# Altium schematic sheet Generador de ozono.SchDoc: Generador de ozono
size A; Date: 27/06/2020; CheckedBy: Christian Ledwidth; Author: Nahuel Martinez; SheetNumber: 1; SheetTotal: 1; DocumentName: Generador de ozono
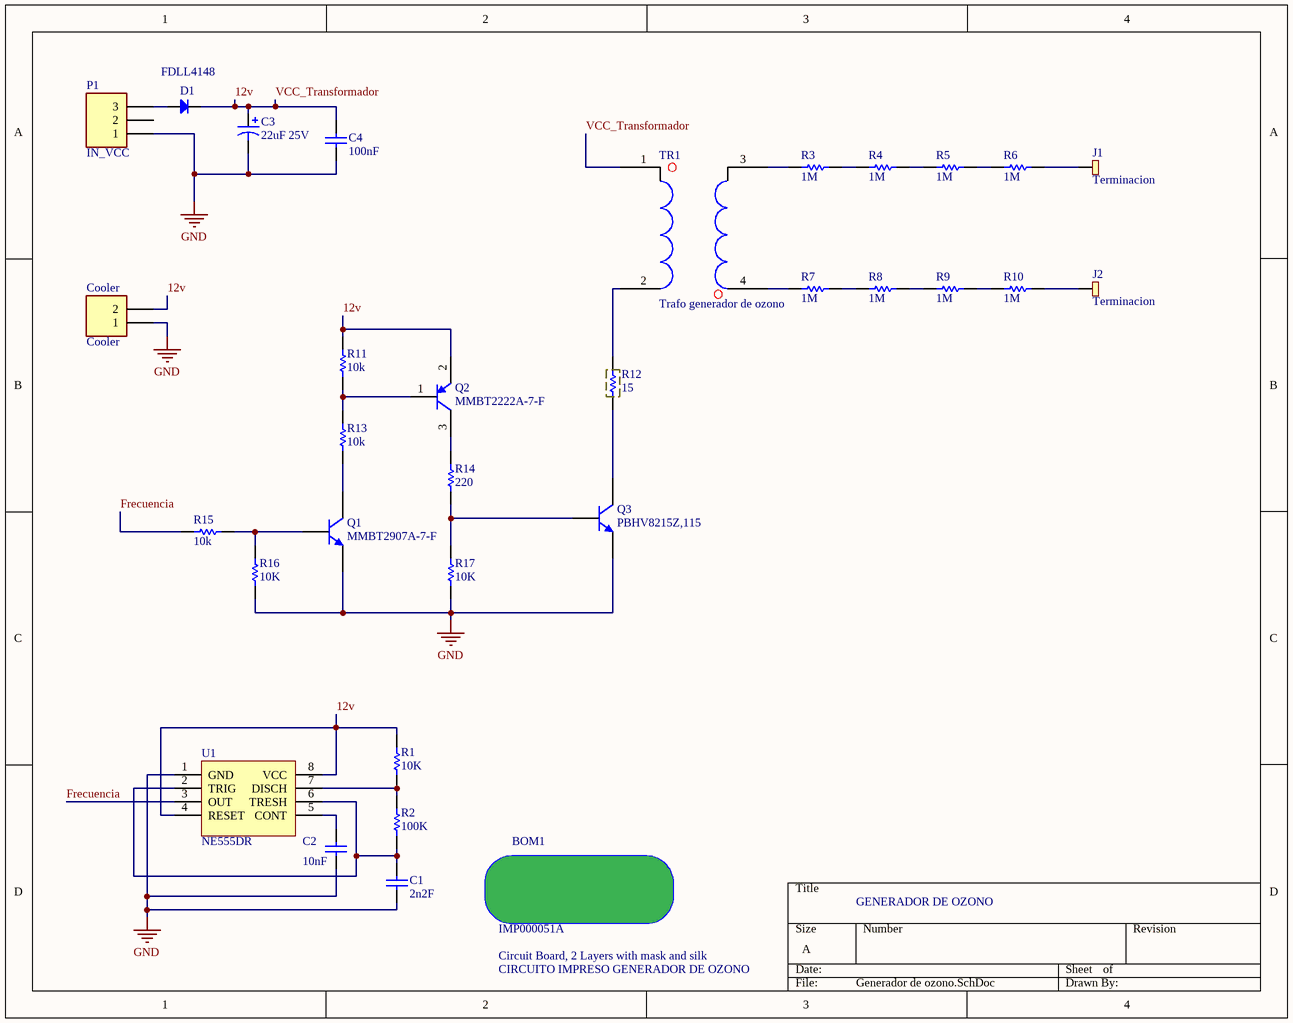
[diagram p0: Generador de ozono.SchDoc]

## Parts
BOM1  CIRCUITO IMPRESO GENERADOR DE OZONO  Codigo Body: IMP000051A  (mechanical)
C1  2n2F  [C_0603]
C2  10nF  [C_0603]
C3  22uF 25V  [CAP100RP]
C4  100nF  [C_0603]
Cooler  Cooler  [B2B-XH-A_3D]
D1  FDLL4148  [SOD-80/MLL34]
J1  Terminacion  [Terminacion]
J2  Terminacion  [Terminacion]
P1  IN_VCC  [B3B-XH-A_3D]
Q1  MMBT2907A-7-F  [SOT23]
Q2  MMBT2222A-7-F  [SOT23]
Q3  PBHV8215Z,115  [SOT223]
R1  10K  [R_0603]
R2  100K  [R_0603]
R3  1M  [R_2512]
R4  1M  [R_2512]
R5  1M  [R_2512]
R6  1M  [R_2512]
R7  1M  [R_2512]
R8  1M  [R_2512]
R9  1M  [R_2512]
R10  1M  [R_2512]
R11  10k  [R_0603]
R12  15  [RES_CEMENTADA_5W_VERT]
R13  10k  [R_0603]
R14  220  [R_1206]
R15  10k  [R_0603]
R16  10K  [R_0603]
R17  10K  [R_0603]
TR1  Trafo generador de ozono  [TRAFO VACIO]
U1  NE555DR  [SOIC8]

## Nets
GND: C1.1 C2.1 C3.2 C4.1 Cooler.1 P1.1 Q1.2(E) Q3.3(E) R16.1 R17.1 U1.1(GND)
12v: C3.1 C4.2 Cooler.2 D1.2(K) Q2.2(E) R1.2 R11.2 TR1.1 U1.4(RESET) U1.8(VCC)  [also labelled VCC_Transformador]
Frecuencia: R15.2 U1.3(OUT)
NetC1_2: C1.2 R2.1 U1.2(TRIG) U1.6(TRESH)
NetC2_2: C2.2 U1.5(CONT)
NetD1_1: D1.1(A) P1.3
NetJ1_?1: J1.?1 R6.2
NetJ2_?1: J2.?1 R10.2
NetQ1_1: Q1.1(B) R15.1 R16.2
NetQ1_3: Q1.3(C) R13.1
NetQ2_1: Q2.1(B) R11.1 R13.2
NetQ2_3: Q2.3(C) R14.2
NetQ3_1: Q3.1(B) R14.1 R17.2
NetQ3_2: Q3.2(C) R12.2
NetR1_1: R1.1 R2.2 U1.7(DISCH)
NetR3_1: R3.1 TR1.3
NetR3_2: R3.2 R4.1
NetR4_2: R4.2 R5.1
NetR5_2: R5.2 R6.1
NetR7_1: R7.1 TR1.4
NetR7_2: R7.2 R8.1
NetR8_2: R8.2 R9.1
NetR9_2: R9.2 R10.1
NetR12_1: R12.1 TR1.2

Not connected (* = marked no-connect by the designer): P1 2

## Notes on the sheet
- GENERADOR DE OZONO

## Library data of the parts
BOM1 = CIRCUITO IMPRESO: Circuit Board, 2 Layers with mask and silk; Fabricante: PCBCART; Note: Circuit Board, 2 Layers with mask and silk; Value: CIRCUITO IMPRESO GENERADOR DE OZONO; Cod.Fabricante: IMP000051A
C1 = C_2n2F_0603: CAP CER 2200PF 50V X7R 0603; Note: Footprint corresponds to dimensions for bulk cassette packaging. This case size has tightened tolerances.; Cod.Fabricante: C0603C222M5RACTU; Fabricante: KEMET; Published: 17-Jul-2002; LatestRevisionDate: 19-Mar-2004; LatestRevisionNote: Silkscreen size reduced.; DatasheetDocument: Mar-2001; PackageDocument: Mar-2001; PackageReference: 0603; Publisher: Altium Limited; ComponentLink1Description: Manufacturer Link; ComponentLink1URL: http://www.kemet.com/; ComponentLink2Description: Datasheet; ComponentLink2URL: https://api.kemet.com/component-edge/download/datasheet/C0603C103M5RACTU.pdf; Cod.Digikey: 399-9042-1-ND; Value: 2n2F; DIGIKEYx100: 0.02980
C2 = C_10nF_0603: CAP CER 10000PF 50V X7R 0603; Note: Footprint corresponds to dimensions for bulk cassette packaging. This case size has tightened tolerances.; Cod.Fabricante: C0603C103M5RACTU; Fabricante: KEMET; Published: 17-Jul-2002; LatestRevisionDate: 19-Mar-2004; LatestRevisionNote: Silkscreen size reduced.; DatasheetDocument: Mar-2001; PackageDocument: Mar-2001; PackageReference: 0603; Publisher: Altium Limited; ComponentLink1Description: Manufacturer Link; ComponentLink1URL: http://www.kemet.com/; ComponentLink2Description: Datasheet; ComponentLink2URL: https://api.kemet.com/component-edge/download/datasheet/C0603C103M5RACTU.pdf; Cod.Digikey: 399-7842-1-ND; Value: 10nF; DIGIKEYx100: 0.01550
C3 = CAP_ALUM_22UF_25V: CAP ALUM 22UF 20% 25V RADIAL; Cod.Fabricante: UVR1E220MDD; Fabricante: Nichicon; Published: 8-Jun-2000; LatestRevisionDate: 17-Jul-2002; LatestRevisionNote: Re-released for DXP Platform.; Publisher: Altium Limited; PackageDescription: Radial, Can; Value: 22uF 25V; Cod.Digikey: 493-1058-ND; DIGIKEYx100: 0.08420; ComponentLink2URL: http://nichicon-us.com/english/products/pdfs/e-uvr.pdf; ComponentLink2Description: Datasheet
C4 = C_100nF_0603: CAP CER 0.1UF 50V X7R 0603; Note: Footprint corresponds to dimensions for bulk cassette packaging. This case size has tightened tolerances.; Cod.Fabricante: C0603C104M5RACTU; Fabricante: KEMET; Published: 17-Jul-2002; LatestRevisionDate: 19-Mar-2004; LatestRevisionNote: Silkscreen size reduced.; DatasheetDocument: Mar-2001; PackageDocument: Mar-2001; PackageReference: 0603; Publisher: Altium Limited; ComponentLink1Description: Manufacturer Link; ComponentLink1URL: http://www.kemet.com/; ComponentLink2Description: Datasheet; ComponentLink2URL: https://api.kemet.com/component-edge/download/datasheet/C0603C104M5RACTU.pdf; Cod.Digikey: 399-7845-1-ND; Value: 100nF; DIGIKEYx100: 0.01740
Cooler = JST_2.5_2: CONN HEADER XH TOP 2POS 2.5MM; Cod.Fabricante: B2B-XH-A(LF)(SN); Fabricante: JST Sales America Inc.; LatestRevisionDate: 17-Jul-2002; LatestRevisionNote: Re-released for DXP Platform.; Publisher: Altium Limited; Cod.Digikey: 455-2247-ND; DIGIKEYx100: 0.0868; ComponentLink2URL: http://www.jst-mfg.com/product/pdf/eng/eXH.pdf; ComponentLink2Description: Datasheet
D1 = Diode FDLL4148: DIODE GEN PURP 100V 200MA LL34/SOD80/MINI MELF; Fabricante: ON Semiconductor; Published: 8-Jun-2000; LatestRevisionDate: 17-Jul-2002; LatestRevisionNote: Re-released for DXP Platform.; DatasheetDocument: 1998; PackageDocument: Aug-1999; PackageReference: MINI MELF; Publisher: Altium Limited; Code_JEDEC: MINI MELF; ComponentLink1Description: Manufacturer Link; ComponentLink1URL: https://www.fairchildsemi.com; ComponentLink2Description: Datasheet; ComponentLink2URL: https://www.fairchildsemi.com/datasheets/FD/FDLL4148.pdf; Value: FDLL4148; Cod.Digikey: FDLL4148CT-ND; Cod.Fabricante: FDLL4148; DIGIKEYx100: 0.0487
J1 J2 = Terminacion: Pad para terminar un camino - No es un componente; Value: No es un componente
P1 = JST_2.5_3: CONN HEADER XH TOP 3POS 2.5MM; Cod.Fabricante: B3B-XH-A(LF)(SN); Fabricante: JST Sales America Inc.; LatestRevisionDate: 17-Jul-2002; LatestRevisionNote: Re-released for DXP Platform.; Publisher: Altium Limited; Cod.Digikey: 455-2248-ND; ComponentLink2Description: Datasheet; ComponentLink2URL: http://www.jst-mfg.com/product/pdf/eng/eXH.pdf; DIGIKEYx100: 0.1115
Q1 = MMBT2907A-7-F: TRANS PNP 60V 0.6A SOT23-3; Fabricante: Diodes Incorporated; PackageReference: SOT-23-3; Publisher: Altium Limited; PackageDescription: SOT-23-3; ComponentLink1Description: Manufacturer Link; ComponentLink1URL: https://media.digikey.com/pdf/Data%20Sheets/Diodes%20PDFs/MMBT2907A_Rev2016.pdf; ComponentLink2Description: Datasheet; ComponentLink2URL: https://media.digikey.com/pdf/Data%20Sheets/Diodes%20PDFs/MMBT2907A_Rev2016.pdf; Value: MMBT2907A-7-F; Cod.Digikey: MMBT2907A-FDICT-ND; Cod.Fabricante: MMBT2907A-7-F; DIGIKEYx100: 0.05110
Q2 = MMBT2222A-7-F: TRANS NPN 40V 0.6A SMD SOT23-3; Fabricante: Diodes Incorporated; LatestRevisionDate: 17-Jul-2002; LatestRevisionNote: Re-released for DXP Platform.; PackageReference: SOT-23-3; Publisher: Altium Limited; ComponentLink1Description: Manufacturer Link; ComponentLink1URL: https://www.diodes.com/assets/Datasheets/ds30041.pdf; ComponentLink2Description: Datasheet; ComponentLink2URL: https://www.diodes.com/assets/Datasheets/ds30041.pdf; Value: MMBT2222A-7-F; Cod.Digikey: MMBT2222A-FDICT-ND; Cod.Fabricante: MMBT2222A-7-F; DIGIKEYx100: 0.05000
Q3 = PBHV8215Z,115: TRANS NPN 150V 2A SOT223; Fabricante: Nexperia USA Inc.; PackageReference: SOT-223; Publisher: Altium Limited; PackageDescription: SOT-223; ComponentLink1Description: Manufacturer Link; ComponentLink1URL: https://assets.nexperia.com/documents/data-sheet/PBHV8215Z.pdf; ComponentLink2Description: Datasheet; ComponentLink2URL: https://assets.nexperia.com/documents/data-sheet/PBHV8215Z.pdf; Value: PBHV8215Z,115; Cod.Digikey: 1727-5084-6-ND; Cod.Fabricante: PBHV8215Z,115; DIGIKEYx100: 0.27300
R1 R11 R13 R15-R17 = R_10k_0603: RES SMD 10K OHM 5% 1/10W 0603; Cod.Fabricante: RC0603JR-0710KL; Fabricante: Yageo; Published: 8-Jun-2000; LatestRevisionDate: 17-Jul-2002; LatestRevisionNote: Re-released for DXP Platform.; PackageReference: 0603; Publisher: Altium Limited; Cod.Digikey: 311-10KGRCT-ND; DIGIKEYx100: 0.00770
  R1 R16 R17: Value: 10K
  R11 R13 R15: Value: 10k
R2 = R_100k_0603: RES SMD 100K OHM 5% 1/10W 0603; Cod.Fabricante: RC0603JR-07100KL; Fabricante: Yageo; Published: 8-Jun-2000; LatestRevisionDate: 17-Jul-2002; LatestRevisionNote: Re-released for DXP Platform.; PackageReference: 0603; Publisher: Altium Limited; Cod.Digikey: 311-100KGRCT-ND; Value: 100K; DIGIKEYx100: 0.00770
R3-R10 = R_1M_2512: 1 MOhms ±5% 1W Chip Resistor 2512 (6432 Metric) High Voltage Thick Film; Cod.Fabricante: CHV2512-JW-105ELF; Fabricante: Bourns Inc.; Published: 8-Jun-2000; LatestRevisionDate: 17-Jul-2002; LatestRevisionNote: Re-released for DXP Platform.; PackageReference: 2512; Publisher: Altium Limited; Cod.Digikey: 118-CHV2512-JW-105ELFCT-ND; Value: 1M; DIGIKEYx100: 0.27280
R12 = Resistor-15_5W: 15 Ohms ±5% 5W Through Hole Resistor Radial; Cod.Fabricante: SQMW515RJ; Fabricante: TE Connectivity Passive Product; Published: 8-Jun-2000; LatestRevisionDate: 17-Jul-2002; LatestRevisionNote: Re-released for DXP Platform.; PackageReference: AXIAL; Publisher: Altium Limited; PackageDescription: 0.512" L x 0.354" W (13.00mm x 9.00mm); Value: 15; Cod.Digikey: A102188-ND; ComponentLink1Description: Datasheet; ComponentLink1URL: https://www.te.com/commerce/DocumentDelivery/DDEController?Action=srchrtrv&DocNm=1773285&DocType=DS&DocLang=English; ComponentLink2Description: Packaging specs; ComponentLink2URL: *; DatasheetVersion: *; DIGIKEYx100: 0.33950; PackageVersion: *
R14 = R_220_1206: 220 Ohms ±5% 0.5W, 1/2W Chip Resistor 1206; Cod.Fabricante: ESR18EZPJ221; Fabricante: Rohm Semiconductor; Published: 8-Jun-2000; LatestRevisionDate: 17-Jul-2002; LatestRevisionNote: Re-released for DXP Platform.; PackageReference: 1206; Publisher: Altium Limited; Cod.Digikey: RHM220ICT-ND; Value: 220; DIGIKEYx100: 0.05200
TR1 = Trafo alta tension: Transformador RF; Fabricante: Varios Nacionales; Cod.Body: TRF000XXX; Cod.Fabricante: TRF000XXX Transformador alta tension; Value: Trafo generador de ozono; Cod.Digikey: -
U1 = NE555DR: IC OSC SGL TIMER 100KHZ 8-SOIC; Fabricante: Texas Instruments; Cod.DigiKey: 296-6501-1-ND; Cod.Fabricante: NE555DR; ComponentLink1Description: Manufacturer Link; ComponentLink1URL: http://www.ti.com/general/docs/suppproductinfo.tsp?distId=10&gotoUrl=http%3A%2F%2Fwww.ti.com%2Flit%2Fgpn%2Fne555; ComponentLink2Description: Datasheet; ComponentLink2URL: http://www.ti.com/general/docs/suppproductinfo.tsp?distId=10&gotoUrl=http%3A%2F%2Fwww.ti.com%2Flit%2Fgpn%2Fne555; DatasheetVersion: I; DIGIKEYx100: 0.17100; LatestRevisionDate: *; LatestRevisionNote: *; PackageDescription: 8-SOIC; PackageReference: 8-SOIC; PackageVersion: *; Published: 29-sep-00; Publisher: Altium Limited; Value: *